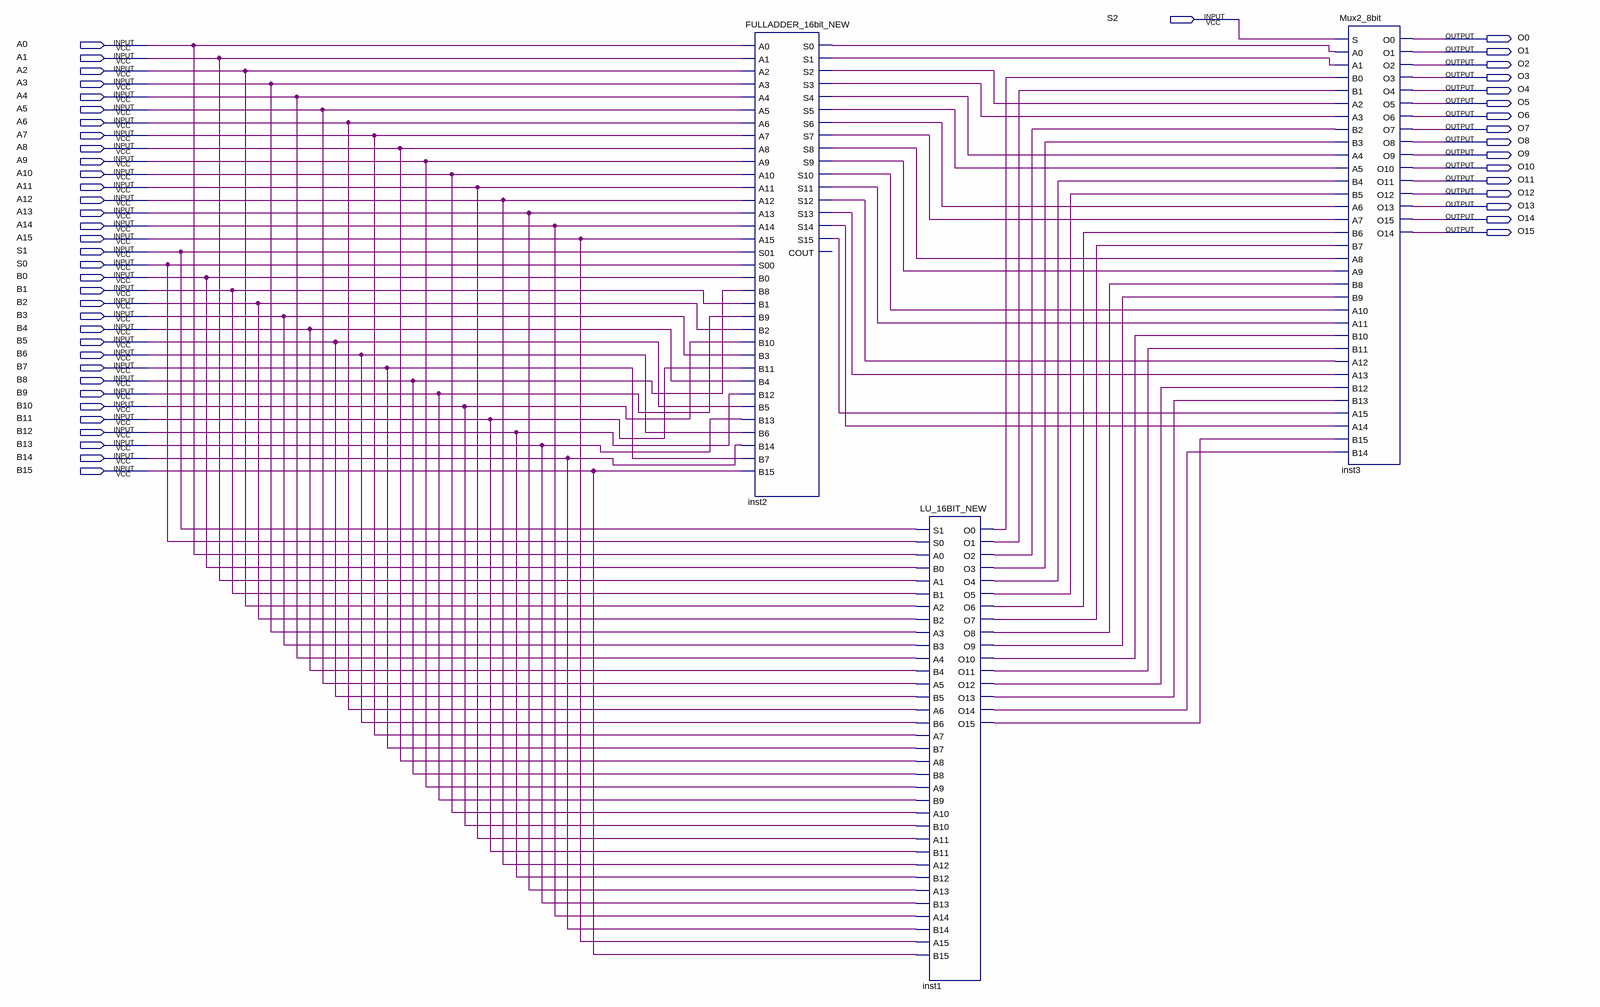
[diagram p0: schematic sheet]
// Quartus schematic ALU_16BIT_Design.bdf as structural Verilog: 3 symbols, 51 pins
module ALU_16BIT_Design (
  input  S2,
  input  A0,
  input  A1,
  input  A2,
  input  A3,
  input  A4,
  input  A5,
  input  A6,
  input  A7,
  input  A8,
  input  A9,
  input  A10,
  input  A11,
  input  A12,
  input  A13,
  input  A14,
  input  A15,
  input  S1,
  input  S0,
  input  B0,
  input  B1,
  input  B2,
  input  B3,
  input  B4,
  input  B5,
  input  B6,
  input  B7,
  input  B8,
  input  B9,
  input  B10,
  input  B11,
  input  B12,
  input  B13,
  input  B14,
  input  B15,
  output O0,
  output O1,
  output O2,
  output O3,
  output O4,
  output O5,
  output O6,
  output O7,
  output O8,
  output O9,
  output O10,
  output O11,
  output O12,
  output O13,
  output O14,
  output O15
);

  wire inst1_o0, inst1_o1, inst1_o2, inst1_o3, inst1_o4, inst1_o5, inst1_o6, inst1_o7, inst1_o8, inst1_o9,
       inst1_o10, inst1_o11, inst1_o12, inst1_o13, inst1_o14, inst1_o15, inst2_s0, inst2_s1, inst2_s2,
       inst2_s3, inst2_s4, inst2_s5, inst2_s6, inst2_s7, inst2_s8, inst2_s9, inst2_s10, inst2_s11, inst2_s12,
       inst2_s13, inst2_s14, inst2_s15;

  FULLADDER_16bit_NEW inst2 (
    .A0(A0), .A1(A1), .A2(A2), .A3(A3), .A4(A4), .A5(A5), .A6(A6), .A7(A7), .A8(A8), .A9(A9), .A10(A10),
    .A11(A11), .A12(A12), .A13(A13), .A14(A14), .A15(A15), .S01(S1), .S00(S0), .B0(B0), .B8(B8), .B1(B1),
    .B9(B9), .B2(B2), .B10(B10), .B3(B3), .B11(B11), .B4(B4), .B12(B12), .B5(B5), .B13(B13), .B6(B6),
    .B14(B14), .B7(B7), .B15(B15), .S0(inst2_s0), .S1(inst2_s1), .S2(inst2_s2), .S3(inst2_s3), .S4(inst2_s4),
    .S5(inst2_s5), .S6(inst2_s6), .S7(inst2_s7), .S8(inst2_s8), .S9(inst2_s9), .S10(inst2_s10),
    .S11(inst2_s11), .S12(inst2_s12), .S13(inst2_s13), .S14(inst2_s14), .S15(inst2_s15));  // open: COUT
  LU_16BIT_NEW inst1 (
    .S1(S1), .S0(S0), .A0(A0), .B0(B0), .A1(A1), .B1(B1), .A2(A2), .B2(B2), .A3(A3), .B3(B3), .A4(A4),
    .B4(B4), .A5(A5), .B5(B5), .A6(A6), .B6(B6), .A7(A7), .B7(B7), .A8(A8), .B8(B8), .A9(A9), .B9(B9),
    .A10(A10), .B10(B10), .A11(A11), .B11(B11), .A12(A12), .B12(B12), .A13(A13), .B13(B13), .A14(A14),
    .B14(B14), .A15(A15), .B15(B15), .O0(inst1_o0), .O1(inst1_o1), .O2(inst1_o2), .O3(inst1_o3),
    .O4(inst1_o4), .O5(inst1_o5), .O6(inst1_o6), .O7(inst1_o7), .O8(inst1_o8), .O9(inst1_o9),
    .O10(inst1_o10), .O11(inst1_o11), .O12(inst1_o12), .O13(inst1_o13), .O14(inst1_o14), .O15(inst1_o15));
  Mux2_8bit inst3 (
    .S(S2), .A0(inst2_s0), .A1(inst2_s1), .B0(inst1_o0), .B1(inst1_o1), .A2(inst2_s2), .A3(inst2_s3),
    .B2(inst1_o2), .B3(inst1_o3), .A4(inst2_s4), .A5(inst2_s5), .B4(inst1_o4), .B5(inst1_o5), .A6(inst2_s6),
    .A7(inst2_s7), .B6(inst1_o6), .B7(inst1_o7), .A8(inst2_s8), .A9(inst2_s9), .B8(inst1_o8), .B9(inst1_o9),
    .A10(inst2_s10), .A11(inst2_s11), .B10(inst1_o10), .B11(inst1_o11), .A12(inst2_s12), .A13(inst2_s13),
    .B12(inst1_o12), .B13(inst1_o13), .A15(inst2_s15), .A14(inst2_s14), .B15(inst1_o15), .B14(inst1_o14),
    .O0(O0), .O1(O1), .O2(O2), .O3(O3), .O4(O4), .O5(O5), .O6(O6), .O7(O7), .O8(O8), .O9(O9), .O10(O10),
    .O11(O11), .O12(O12), .O13(O13), .O15(O14), .O14(O15));
endmodule
